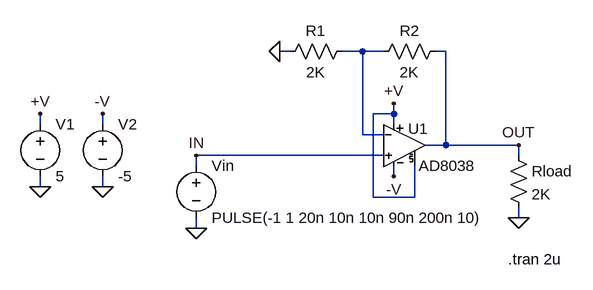
[diagram p0: schematic AD8038.asc]
AD8038.asc, the LTspice schematic file:
Version 4
SHEET 1 1240 700
WIRE 400 -1248 384 -1248
WIRE 512 -1248 480 -1248
WIRE 544 -1248 512 -1248
WIRE 640 -1248 624 -1248
WIRE 560 -1152 560 -1168
WIRE 560 -1152 528 -1152
WIRE 16 -1136 16 -1152
WIRE 112 -1136 112 -1152
WIRE 560 -1136 560 -1152
WIRE 512 -1120 512 -1248
WIRE 544 -1120 512 -1120
WIRE 640 -1104 640 -1248
WIRE 640 -1104 608 -1104
WIRE 752 -1104 640 -1104
WIRE 544 -1088 256 -1088
WIRE 752 -1088 752 -1104
WIRE 256 -1072 256 -1088
WIRE 560 -1056 560 -1072
WIRE 16 -1040 16 -1056
WIRE 112 -1040 112 -1056
WIRE 528 -1024 528 -1152
WIRE 592 -1024 592 -1072
WIRE 592 -1024 528 -1024
WIRE 752 -992 752 -1008
WIRE 256 -976 256 -992
FLAG 256 -976 0
FLAG 752 -1104 OUT
FLAG 256 -1088 IN
FLAG 560 -1168 +V
FLAG 560 -1056 -V
FLAG 384 -1248 0
FLAG 752 -992 0
FLAG 16 -1152 +V
FLAG 16 -1040 0
FLAG 112 -1152 -V
FLAG 112 -1040 0
SYMBOL voltage 256 -1088 R0
WINDOW 123 24 146 Left 2
WINDOW 39 24 125 Left 2
SYMATTR InstName Vin
SYMATTR Value PULSE(-1 1 20n 10n 10n 90n 200n 10)
SYMBOL res 496 -1264 R90
WINDOW 0 0 56 VBottom 2
WINDOW 3 32 56 VTop 2
SYMATTR InstName R1
SYMATTR Value 2K
SYMBOL res 640 -1264 R90
WINDOW 0 0 56 VBottom 2
WINDOW 3 32 56 VTop 2
SYMATTR InstName R2
SYMATTR Value 2K
SYMBOL res 736 -1104 R0
SYMATTR InstName Rload
SYMATTR Value 2K
SYMBOL Opamps\\AD8038 576 -1104 R0
SYMATTR InstName U1
SYMBOL voltage 16 -1152 R0
WINDOW 123 0 0 Left 2
WINDOW 39 0 0 Left 2
SYMATTR InstName V1
SYMATTR Value 5
SYMBOL voltage 112 -1152 R0
WINDOW 123 24 146 Left 2
WINDOW 39 24 125 Left 2
SYMATTR InstName V2
SYMATTR Value -5
TEXT 736 -928 Left 2 !.tran 2u

The netlist it stands for:
* AD8038.asc
Vin IN 0 PULSE(-1 1 20n 10n 10n 90n 200n 10)
R1 N001 0 2K
R2 OUT N001 2K
Rload OUT 0 2K
XU1 IN N001 +V -V OUT +V AD8038  ; pins 100 101 102 103 104 106
V1 +V 0 5
V2 -V 0 -5
.tran 2u
.lib ADI.lib
.backanno
.end